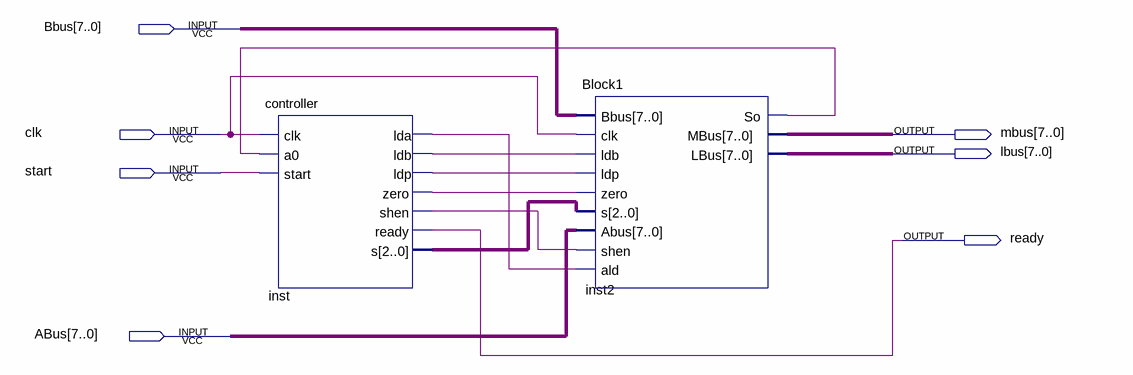
[diagram p0: schematic sheet]
// Quartus schematic Block2.bdf as structural Verilog: 2 symbols, 7 pins
module Block2 (
  input  [7:0] Bbus,
  input  clk,
  input  start,
  input  [7:0] ABus,
  output [7:0] mbus,
  output [7:0] lbus,
  output ready
);

  wire inst2_so, inst_lda, inst_ldb, inst_ldp, inst_shen, inst_zero;
  wire [2:0] inst_s;

  controller inst (
    .clk(clk), .a0(inst2_so), .start(start), .lda(inst_lda), .ldb(inst_ldb), .ldp(inst_ldp),
    .zero(inst_zero), .shen(inst_shen), .ready(ready), .s(inst_s));
  Block1 inst2 (
    .Bbus(Bbus), .clk(clk), .ldb(inst_ldb), .ldp(inst_ldp), .zero(inst_zero), .s(inst_s), .Abus(ABus),
    .shen(inst_shen), .ald(inst_lda), .So(inst2_so), .MBus(mbus), .LBus(lbus));
endmodule
